# EAGLE design Explore Labs GPS Receiver ublox MAX-M8Q (EAGLE 7.5.0)
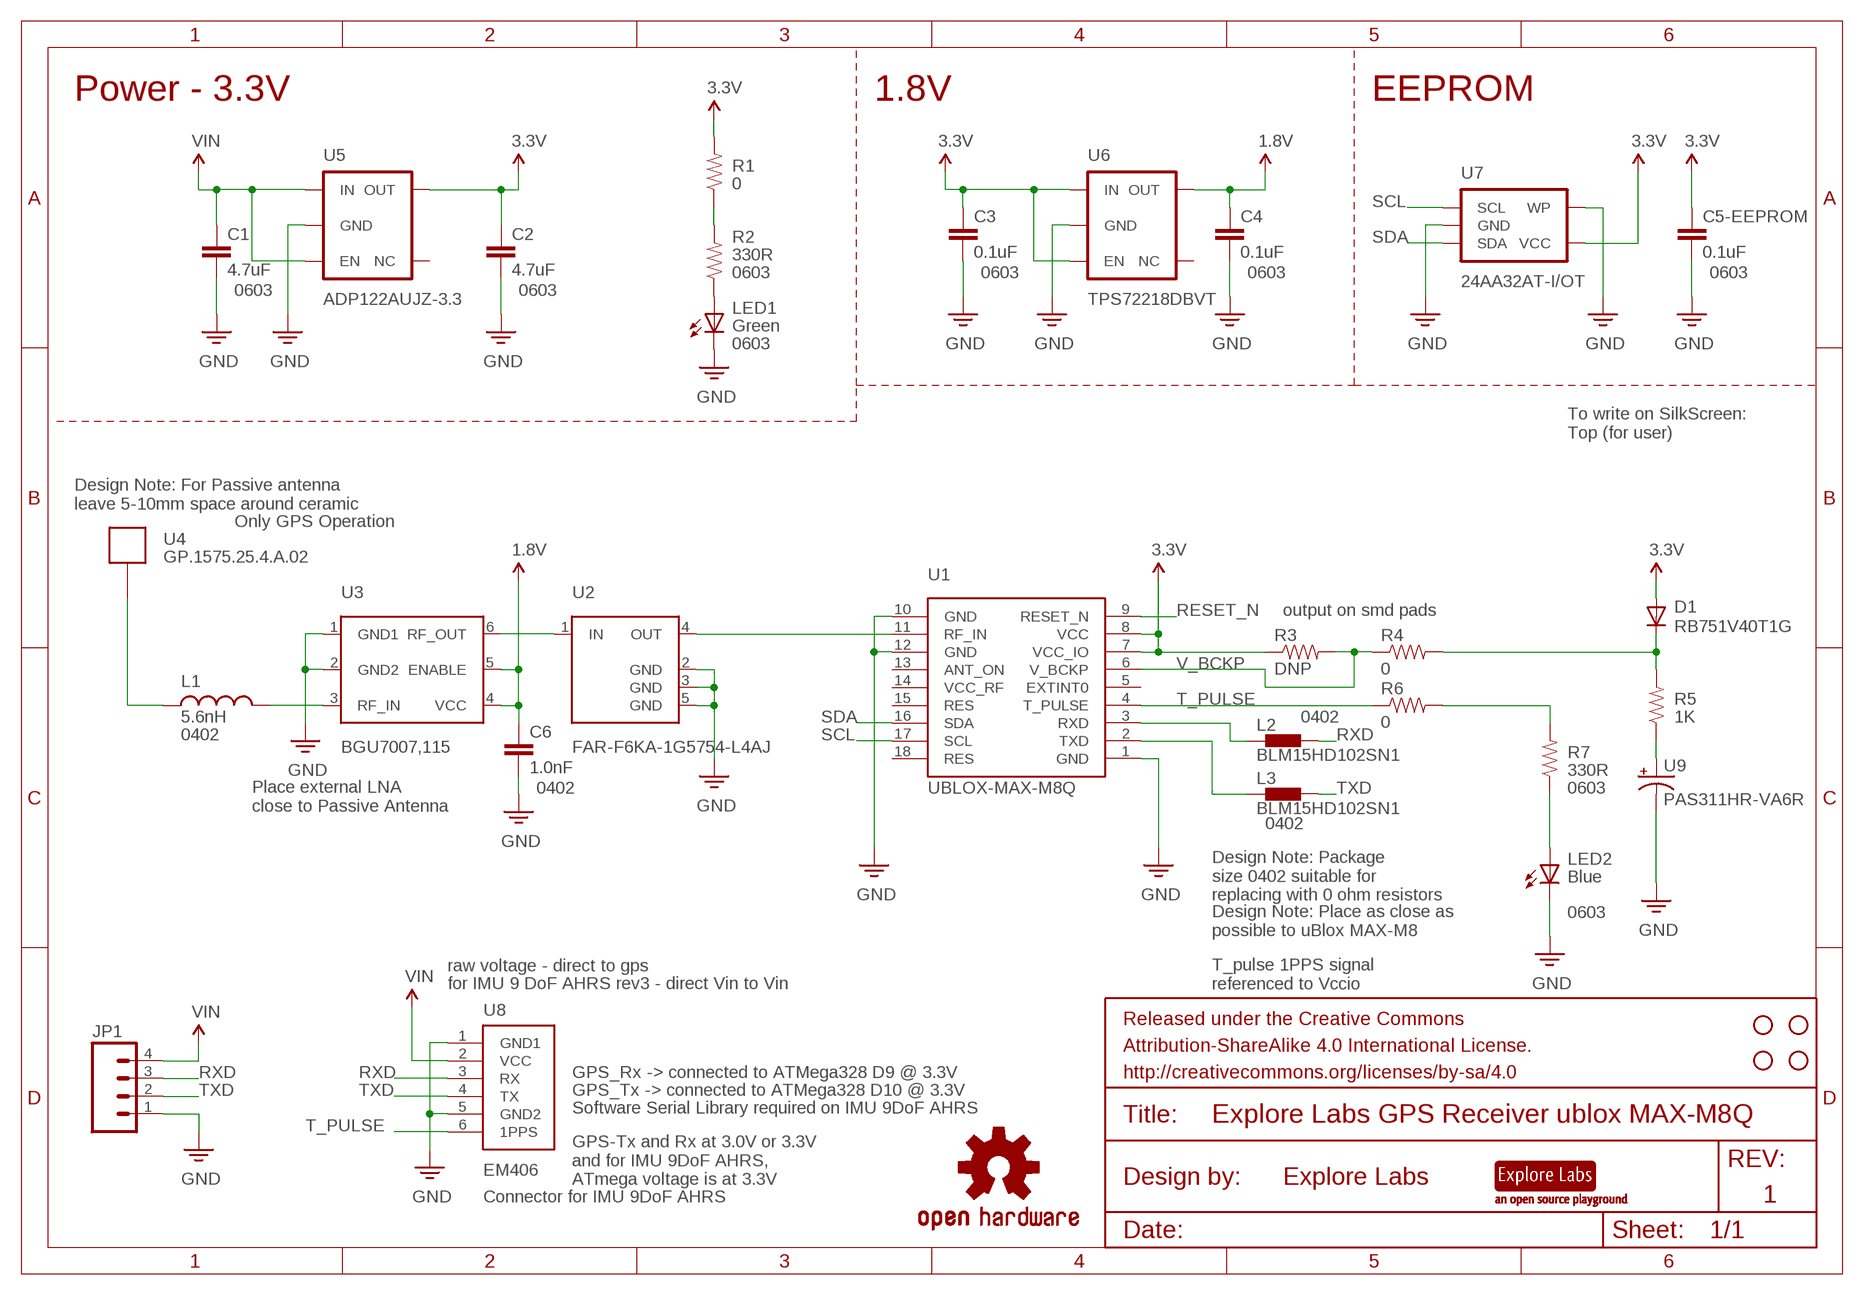
[diagram p0: schematic, sheet 1]

## Parts
C1  4.7uF  CAP0603-CAP  [0603-CAP]
C2  4.7uF  CAP0603-CAP  [0603-CAP]
C3  0.1uF  CAP0603-CAP  [0603-CAP]
C4  0.1uF  CAP0603-CAP  [0603-CAP]
C5-EEPROM  0.1uF  CAP0603-CAP  [0603-CAP]
C6  1.0nF  1.0UF-16V-10%(0402)  [0402-CAP]
D1  RB751V40T1G  DIODESOD  [SOD-323]
JP1  M04PTH  [1X04]
L1  5.6nH  INDUCTOR0402  [C0402]
L2  BLM15HD102SN1  [0402-FERRITE]
L3  BLM15HD102SN1  [0402-FERRITE]
LED1  Green  LEDCHIP-LED0603  [CHIP-LED0603]
LED2  Blue  LEDCHIP-LED0603  [CHIP-LED0603]
LOGO1  OSHW-LOGOTOP  [OSHW-LOGO-M-TOP]
LOGO2  OSHW-LOGOBOTTOM  [OSHW-LOGO-M-BOTTOM]
R1  0  RESISTOR0603-RES  [0603-RES]
R2  330R  RESISTOR0603-RES  [0603-RES]
R3  DNP  RESISTOR0603-RES  [0603-RES]
R4  0  RESISTOR0603-RES  [0603-RES]
R5  1K  RESISTOR0603-RES  [0603-RES]
R6  0  RESISTOR0603-RES  [0603-RES]
R7  330R  RESISTOR0603-RES  [0603-RES]
STANDOFF1  STAND-OFF  [STAND-OFF]
STANDOFF2  STAND-OFF  [STAND-OFF]
STANDOFF3  STAND-OFF  [STAND-OFF]
STANDOFF4  STAND-OFF  [STAND-OFF]
U1  UBLOX-MAX-M8Q  [UBLOX-MAX-M8]
U2  FAR-F6KA-1G5754-L4AJ  [QCS5E]
U3  BGU7007,115  [SOT886]
U4  GP.1575.25.4.A.02  [GP.1575.25.4.A.02]
U5  ADP122AUJZ-3.3  [SOT-23-5]
U6  TPS72218DBVT  [SOT-23-5]
U7  24AA32AT-I/OT  [SOT-23-5]
U8  EM406  [EM406]
U9  PAS311HR-VA6R  [PA311]
U$9  EXPLORE-LABS-LOGO  [EXPLORE-LABS-LOGO-TOP]

## Nets
1.8V: C4.1 C6.1 U3.4(VCC) U3.5(ENABLE) U6.5(OUT)
3.3V: C2.1 C3.1 C5-EEPROM.1 D1.2(A) R1.2 R3.1 U1.7(VCC_IO) U1.8(VCC) U5.5(OUT) U6.1(IN) U6.3(EN) U7.4(VCC)
GND: C1.2 C2.2 C3.2 C4.2 C5-EEPROM.2 C6.2 JP1.1 LED1.C LED2.C U1.1(GND) U1.10(GND) U1.12(GND) U2.2(GND) U2.3(GND) U2.5(GND) U3.1(GND1) U3.2(GND2) U5.2(GND) U6.2(GND) U7.2(GND) U7.5(WP) U8.1(GND1) U8.5(GND2) U9.P$2(-)
N$1 [RF]: U2.1(IN) U3.6(RF_OUT)
N$2: R5.1 U9.P$1(+)
N$3: L2.1 U1.3(RXD)
N$4: R6.2 R7.2
N$5: LED2.A R7.1
N$6: L3.1 U1.2(TXD)
N$7 [RF]: U1.11(RF_IN) U2.4(OUT)
N$8: D1.1(C) R4.2 R5.2
N$9 [RF]: L1.2 U3.3(RF_IN)
N$10: R1.1 R2.2
N$11 [RF]: L1.1 U4.1(PIN)
N$15: LED1.A R2.1
RESET_N: U1.9(RESET_N)
RXD: JP1.3 L2.2 U8.3(RX)
SCL: U1.17(SCL) U7.1(SCL)
SDA: U1.16(SDA) U7.3(SDA)
T_PULSE: R6.1 U1.4(T_PULSE) U8.6(1PPS)
TXD: JP1.2 L3.2 U8.4(TX)
V_BCKP: R3.2 R4.1 U1.6(V_BCKP)
VIN: C1.1 JP1.4 U5.1(IN) U5.3(EN) U8.2(VCC)
Unconnected: U1.5(EXTINT0) U1.13(ANT_ON) U1.14(VCC_RF) U1.15(RES) U1.18(RES) U5.4(NC) U6.4(NC)

## Notes on the sheet
- Power - 3.3V | 1.8V | EEPROM
- 0603 | 0603 | 0603 | 0603
- 0603 | 0603
- 0603
- To write on SilkScreen:
  Top (for user)
- Design Note: For Passive antenna
  leave 5-10mm space around ceramic
- Only GPS Operation
- output on smd pads
- 0402
- 0402
- 0402 | 0603
- Place external LNA
  close to Passive Antenna
- 0402
- Design Note: Package
  size 0402 suitable for
  replacing with 0 ohm resistors
- 0603
- Design Note: Place as close as
  possible to uBlox MAX-M8
- raw voltage - direct to gps
- for IMU 9 DoF AHRS rev3 - direct Vin to Vin
- T_pulse 1PPS signal
  referenced to Vccio
- GPS_Rx -> connected to ATMega328 D9 @ 3.3V
- GPS_Tx -> connected to ATMega328 D10 @ 3.3V
- Software Serial Library required on IMU 9DoF AHRS
- GPS-Tx and Rx at 3.0V or 3.3V
  and for IMU 9DoF AHRS,
  ATmega voltage is at 3.3V
- Connector for IMU 9DoF AHRS | 1

## Library data of the parts
C1-C4 C5-EEPROM = SparkFun-Capacitors:CAP: Capacitor Standard 0603 ceramic capacitor, and 0.1" leaded capacitor.
C6 = Explore Labs EAGLE Library:1.0UF-16V-10%(0402); PROD_ID: CAP-12417; VALUE: 1.0uF
D1 = Explore Labs EAGLE Library:DIODE: Diode These are standard reverse protection diodes and small signal diodes. SMA package can handle up to about 1A. SOD-323 can handle about 200mA. What the SOD-323 package when ordering, there are some mfgs out there that are 5-pin packages.; PROD_ID: DIO-09646
JP1 = SparkFun-Connectors:M04: Header 4 Standard 4-pin 0.1" header. Use with straight break away headers (SKU : PRT-00116), right angle break away headers (PRT-00553), swiss pins (PRT-00743), machine pins (PRT-00117), and female headers (PRT-00115). Molex polarized connector foot print use with SKU : PRT-08231 with associated crimp pins and housings. 1MM SMD Version SKU: PRT-10208
L1 = SparkFun-Passives:INDUCTOR: Inductors Basic Inductor/Choke - 0603 and 1206. Footprints are not proven and vary greatly between part numbers. INDUCTOR POWER 3.3UH 4.0A SMD 0.197" L x 0.197" W x 0.177" H (5.00mm x 5.00mm x 4.50mm)
L2 L3 = Explore Labs EAGLE Library:BLM15H: EMIFIL (R) Chip Ferrite Bead for GHz Noise Source: http://www.murata.com/ Ferrite Bead BLM15H.pdf
LED1 LED2 = adafruit:LED: LED OSRAM: - CHIPLED LG R971, LG N971, LY N971, LG Q971, LY Q971, LO R971, LY R971 LH N974, LH R974 LS Q976, LO Q976, LY Q976 LO Q996 - Hyper CHIPLED LW Q18S LB Q993, LB Q99A, LB R99A - SideLED LS A670, LO A670, LY A670, LG A670, LP A670 LB A673, LV A673, LT A673, LW A673 LH A674 LY A675 LS A676, LA A676, LO A676, LY A676, LW A676 LS A679, LY A679, LG A679 - Hyper Micro SIDELED® LS Y876, LA Y876, LO Y876, LY Y876 LT Y87S - SmartLED LW L88C, LW L88S LB L89C, LB L89S, LG L890 LS L89K, LO L89K, LY L89K LS L896, LA L896, LO L896, LY L896 - TOPLED LS T670, LO T670, LY T670, LG T670, LP T670 LSG T670, LSP T670, LSY T670, LOP T670, LYG T670 LG T671, LOG T671, LSG T671 LB T673, LV T673, LT T673, LW T673 LH T674 LS T676, LA T676, LO T676, LY T676, LB T676, LH T676, LSB T676, LW T676 LB T67C, LV T67C, LT T67C, LS T67K, LO T67K, LY T67K, LW E67C LS E67B, LA E67B, LO E67B, LY E67B, LB E67C, LV E67C, LT E67C LW T67C LS T679, LY T679, LG T679 LS T770, LO T770, LY T770, LG T770, LP T770 LB T773, LV T773, LT T773, LW T773 LH T774 LS E675, LA E675, LY E675, LS T675 LS T776, LA T776, LO T776, LY T776, LB T776 LHGB T686 LT T68C, LB T68C - Hyper Mini TOPLED® LB M676 - Mini TOPLED Santana® LG M470 LS M47K, LO M47K, LY M47K Source: http://www.osram.convergy.de/
LOGO1 LOGO2 = Explore Labs EAGLE Library:OSHW-LOGO: Open Source Hardware Logo This logo indicates the piece of hardware it is found on incorporates a OSHW license and/or adheres to the definition of open source hardware found here: http://freedomdefined.org/OSHW
R1-R7 = SparkFun-Passives:RESISTOR: Resistor Basic schematic elements and footprints for 0603, 1206, and PTH resistors.
STANDOFF1-STANDOFF4 = SparkFun-Electromechanical:STAND-OFF: #4 Stand Off This is the mechanical footprint for a #4 phillips button head screw. Use the keepout ring to avoid running the screw head into surrounding components. SKU : PRT-00447
U1 = Explore Labs EAGLE Library:UBLOX-MAX-M8
U2 = Explore Labs EAGLE Library:FAR-F6KA-1G5754-L4AJ
U3 = Explore Labs EAGLE Library:BGU7007
U4 = Explore Labs EAGLE Library:GP.1575.25.4.A.02: Taoglas GP.1575.25.4.A.02 4mm thick GPS Patch Antenna, 1575MHz 25mm*25mm*4mm; DATASHEET: http://www.taoglas.com/images/product_images/original_images/GP.1575.25.4.A.02%20GPS%20Patch%20Antenna%201575MHz%20190410.pdf; LINK: http://www.taoglas.com/antennas/GPS-GLONASS_Antennas/Internal_GPS_-_Passive_Ceramic_Patch_Antennas/; MFGPN: GP.1575.25.4.A.02
U5 = Explore Labs EAGLE Library:ADP122
U6 = Explore Labs EAGLE Library:TPS72218
U7 = Explore Labs EAGLE Library:24AA32
U8 = 11xLabs:EM406: EM406 GPS Connector Proven layout and schematic for EM406 connector. Spark Fun Electronics SKU : GPS-00579
U9 = Explore Labs EAGLE Library:PAS311
U$9 = Explore Labs EAGLE Library:EXPLORE-LABS-LOGO

## Net classes
1 RF: width 0.432 mm

## Board
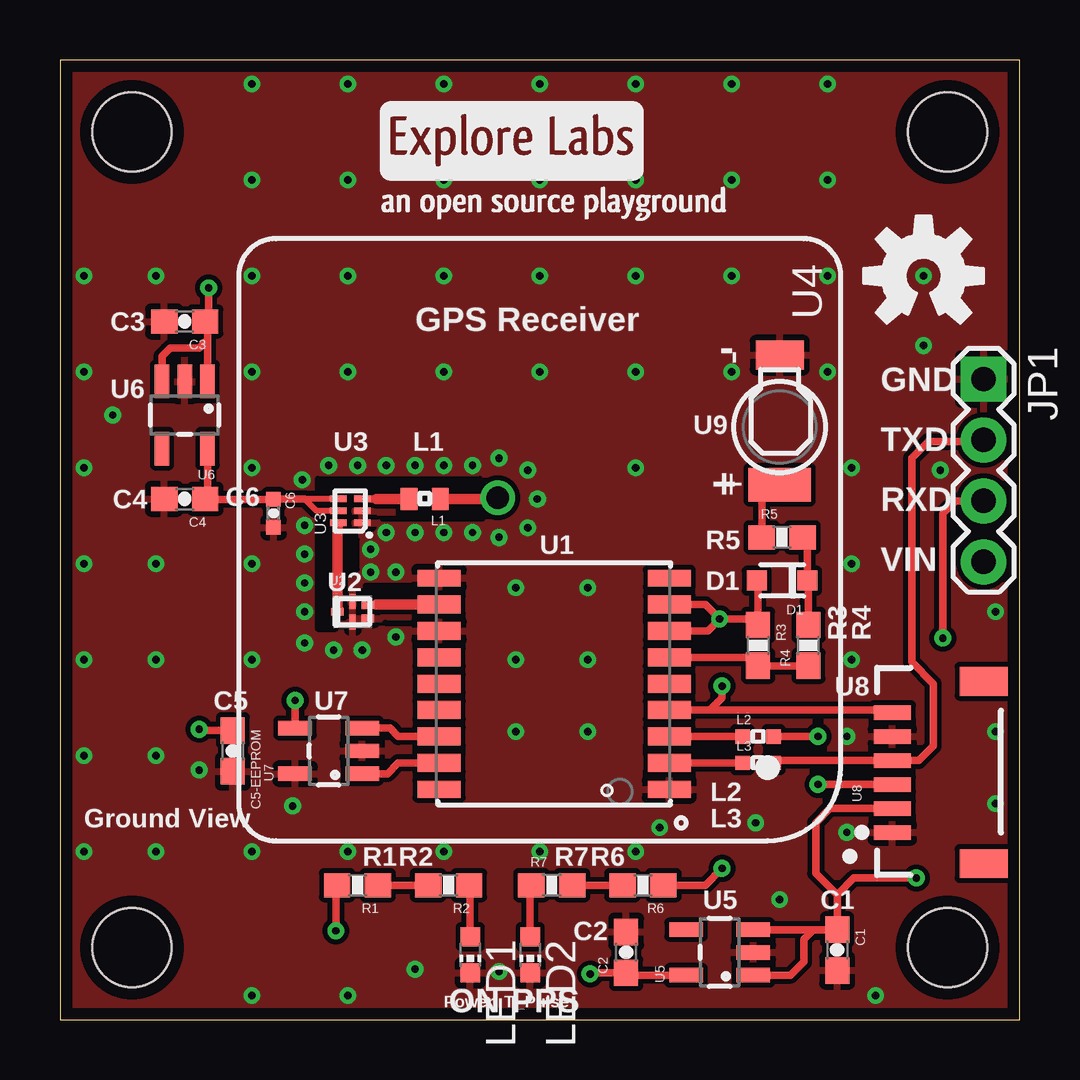
[diagram p1: board, top side]
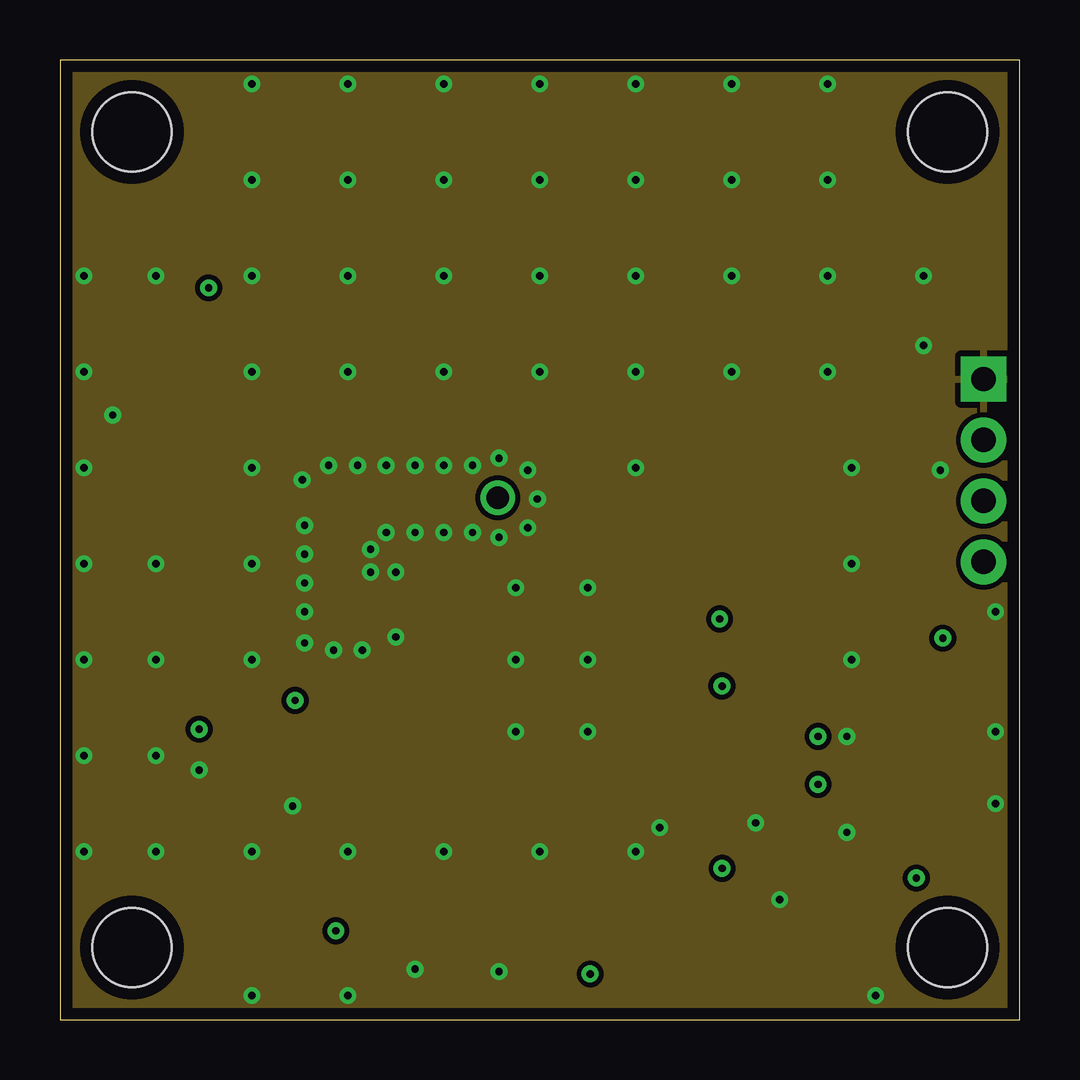
[diagram p2: board, inner layer $GND]
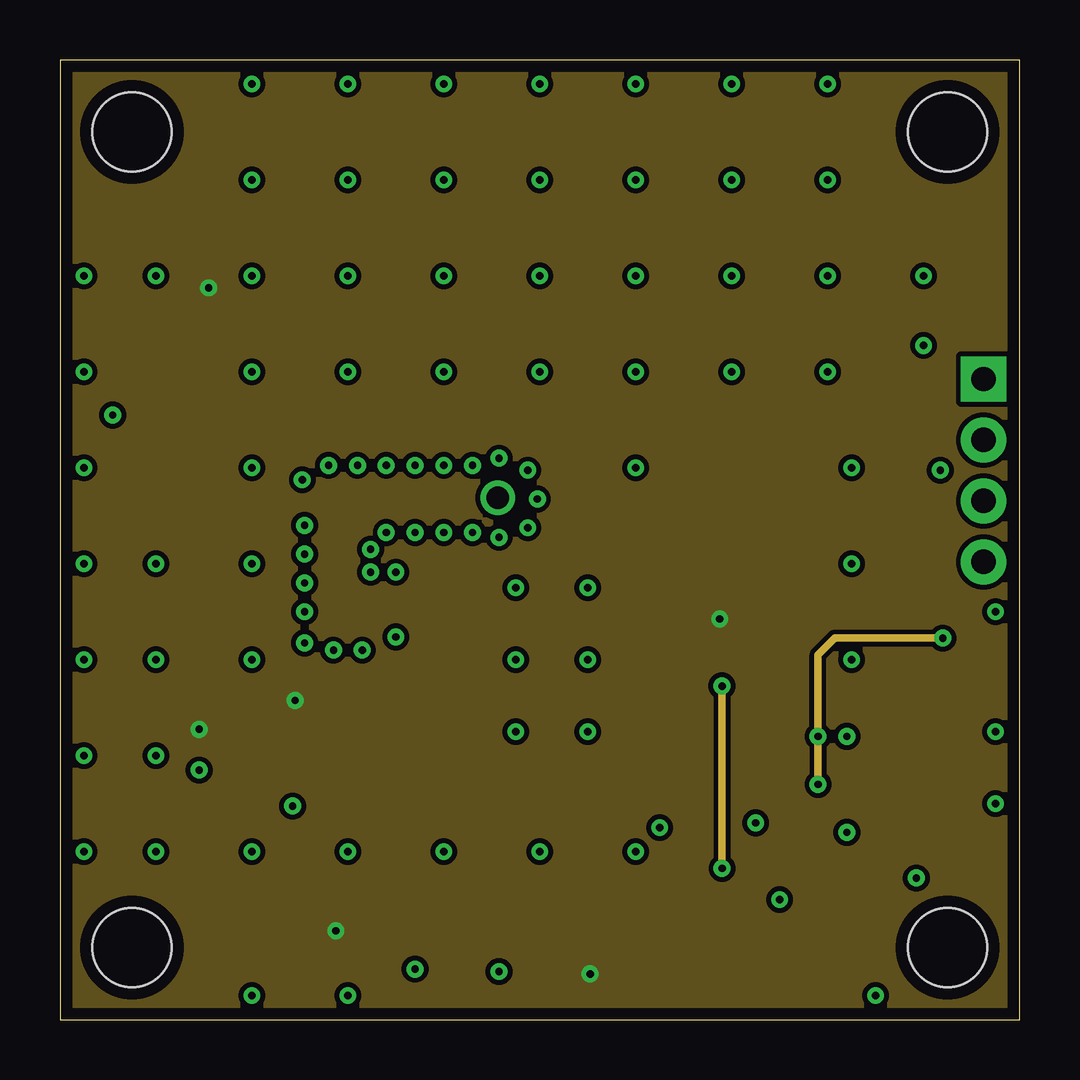
[diagram p3: board, inner layer $VCC]
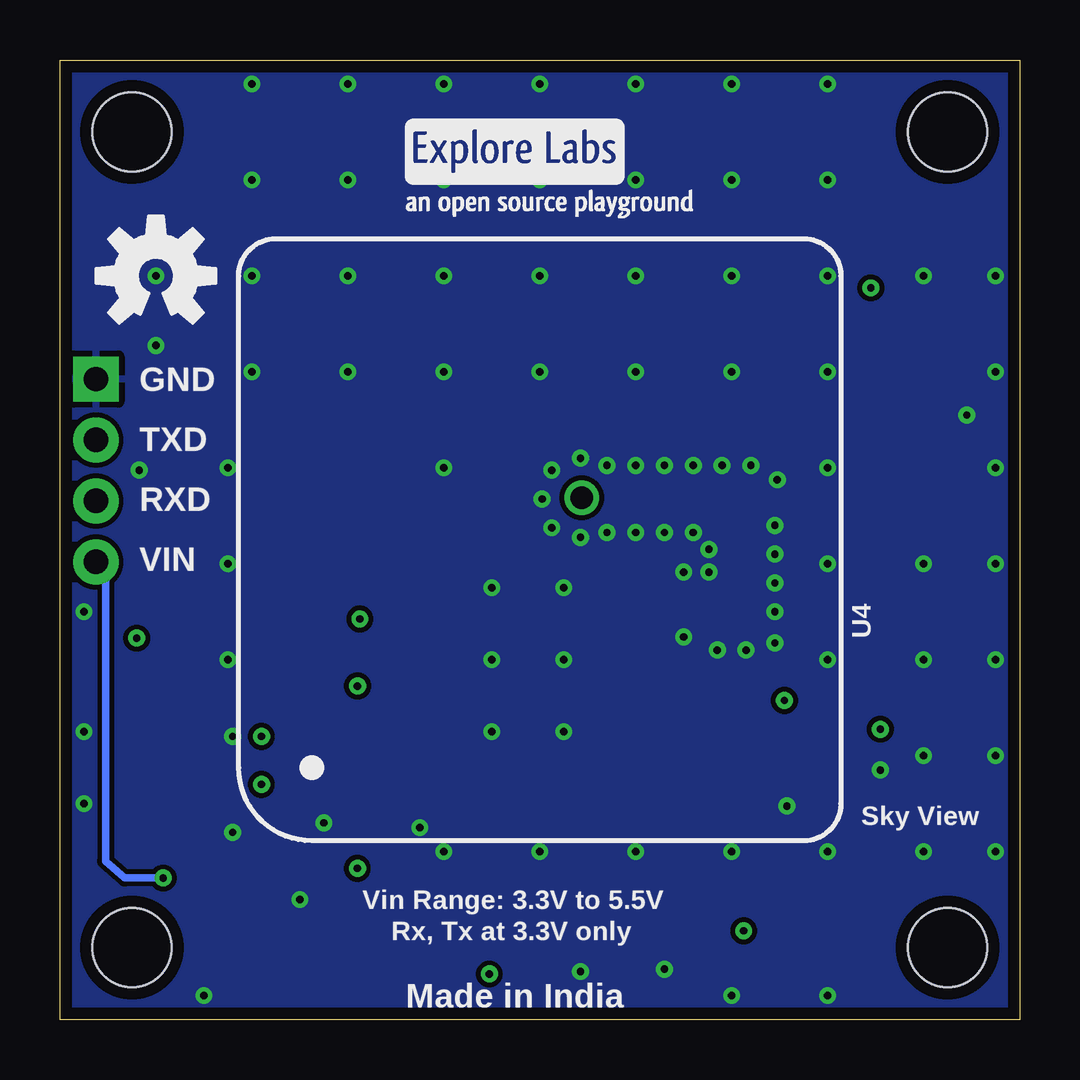
[diagram p4: board, bottom side, seen from below]

Size 40 x 40 mm. Coordinates in mm from the lower left corner, seen from the top.
Outline: 0,0 40,0 40,40 0,40 0,0
Copper layers (1+2*15+16): Top 0.035mm / dielectric 0.25mm / $GND 0.018mm / dielectric 1mm / $VCC 0.018mm / dielectric 0.255mm / Bottom 0.035mm
Design rules "Explore Labs 4 Layer 1dot61mm": minimum track width 10mil, minimum drill 10mil, track to track 8mil, track to pad 8mil, pad to pad 8mil, via to via 8mil, smd to smd 8mil, copper to edge 0.5mm, drill to drill 8mil, minimum pad ring 10mil, minimum via ring 8mil, stop-mask expansion 4mil, vias tented up to drill 18mil, thermal gap 10mil
tRestrict: 10 lines

### Footprints (pad centres in the part's own frame; a part is rotated, then mirrored left to right if it is on the bottom)
0603-CAP = smd 1.1 x 1: 1 -0.85,0; 2 0.85,0
0402-CAP = smd 0.6 x 0.6: 1 -0.58,0; 2 0.58,0
SOD-323 = smd 0.83 x 0.83: 1 -1.05,0; 2 1.05,0
1X04 = drill 1.016 pad 1.88 square: 1 0,0 | drill 1.016 pad 1.88: 2 2.54,0; 3 5.08,0; 4 7.62,0
C0402 = smd 0.7 x 0.9: 1 -0.65,0; 2 0.65,0
0402-FERRITE = smd 0.6 x 0.6: 1 -0.65,0; 2 0.65,0
CHIP-LED0603 = smd 0.8 x 0.8: A 0,-0.75; C 0,0.75
0603-RES = smd 1.1 x 1: 1 -0.85,0; 2 0.85,0
STAND-OFF = hole 3.302: 0,0
UBLOX-MAX-M8 = smd 1.8 x 0.7: 1 4.8,-4.4; 9 4.8,4.4; 10 -4.8,4.4; 18 -4.8,-4.4 | smd 1.8 x 0.75: 2 4.8,-3.3; 3 4.8,-2.2; 4 4.8,-1.1; 5 4.8,0; 6 4.8,1.1; 7 4.8,2.2; 8 4.8,3.3; 11 -4.8,3.3; 12 -4.8,2.2; 13 -4.8,1.1; 14 -4.8,0; 15 -4.8,-1.1; 16 -4.8,-2.2; 17 -4.8,-3.3
QCS5E = smd 0.525 x 0.325: 1 -0.635,0; 3 0.635,-0.285; 4 0.635,0.285 | smd 0.25 x 0.625: 2 0,-0.435; 5 0,0.435
SOT886 = smd 0.27 x 0.7: 1 -0.5,-0.5; 2 0,-0.5; 3 0.5,-0.5; 4 0.5,0.5; 5 0,0.5; 6 -0.5,0.5
GP.1575.25.4.A.02 = drill 0.95: 1 -1.75,-1.75
SOT-23-5 = smd 0.6 x 1.4: 1 -0.95,-1.4; 2 0,-1.4; 3 0.95,-1.4; 4 0.95,1.4; 5 -0.95,1.4
EM406 = smd 0.6 x 1.55: 1 -2.5,1.8; 2 -1.5,1.8; 3 -0.5,1.8; 4 0.5,1.8; 5 1.5,1.8; 6 2.5,1.8 | smd 1.2 x 2: P$1 -3.8,-2; P$2 3.8,-2
PA311 = smd 1.4 x 2.6: P$1 -2.4,0 | smd 1.2 x 2: P$2 3,0

### Placement (x,y rotation side)
C1  32.4,2.9 270 top
C2  23.6,2.8 90 top
C3  5.2,29.1 180 top
C4  5.2,21.7 180 top
C5-EEPROM  7.2,11.2 270 top
C6  8.9,21.1 270 top
D1  30.1,18.3 180 top
JP1  38.5,26.7 270 top
L1  15.2,21.7 180 top
L2  29.1,11.8 0 top
L3  29.1,10.7 0 top
LED1  17.1,2.7 180 top
LED2  19.6,2.7 180 top
LOGO1  36,31 0 top
LOGO2  36,31 0 top
R1  12.4,5.6 180 top
R2  16.2,5.6 180 top
R3  29.1,15.6 270 top
R4  31.2,15.6 90 top
R5  30.1,20.1 0 top
R6  24.3,5.6 180 top
R7  20.5,5.6 0 top
STANDOFF1  37,37 0 top
STANDOFF2  3,3 0 top
STANDOFF3  37,3 0 top
STANDOFF4  3,37 0 top
U1  20.6,14 0 top
U2  12.2,17 0 top
U3  12.1,21.2 90 top
U4  20,20 270 top
U5  27.5,2.8 90 top
U6  5.2,25.2 180 top
U7  11.2,11.2 90 top
U8  36.5,10.3 90 top
U9  30,24.7 90 top
U$9  13.3,33 0 top
U$10  [EXLABS_LOGO_0.25]  26,32.6 0 bottom

### Tracks (layer width: path | path; a pad name or v marks a point on that pad's centre or on a via)
1.8V
  Top 0.254: U3.4 10.2,21.7 10.7,21.2 U3.5
  Top 0.305: 10.2,21.7 8.92,21.7 C6.1 6.07,21.68 C4.1 6.15,21.8 U6.5
3.3V  (via drill 0.3)
  Top 0.254: 6.15,29 C3.1 6.2,29.25
  Top 0.305: U6.3 4.25,27.65 4.6,28 5.8,28 6.15,28.35 | U6.1 6.15,28.35 | 6.15,28.35 6.15,29 | 6.2,29.25 v6.2,30.5 | C5-EEPROM.1 5.8,12.05 v5.8,12.1 | U7.4 | U7.4 v9.8,13.3 | U5.5 23.7,1.85 C2.1 22.15,1.95 v22.1,1.9 | v11.5,3.7 11.5,5.55 R1.2 | U1.8 26.9,17.3 v27.5,16.7 | U1.7 27,16.2 v27.5,16.7 | v27.5,16.7 28.85,16.7 R3.1 29.1,18.25 D1.2
  pour $VCC: 0,52 52,52 52,0 0,0
GND  (via drill 0.3)
  other vias: 10.2,17 14,18.65 10.2,19.4 13.6,20.3 17.2,20.3 14,15.95 12.6,15.4 10.2,15.7 12.4,23.1 13.6,23.1 18.3,23.4 19.5,22.9 19.5,20.5 19.9,21.7 10.2,18.2 10.2,20.6 10.1,22.5 11.2,23.1 14.8,20.3 14.8,23.1 17.2,23.1 5.8,10.4 2.2,25.2 12.95,19.6 18.3,20.1 11.4,15.4 16,23.1 16,20.3 12.95,18.65 9.7,8.9 29,8.2 32.8,11.8 32.8,7.8 12,7 18.3,2 20,39 20,35 16,39 16,35 16,31 20,31 16,27 20,27 24,27 28,27 24,39 24,35 24,31 28,39 28,35 28,31 12,39 12,35 12,31 12,27 32,39 32,35 32,31 32,27 36,31 36,28.1 8,39 8,35 8,31 8,27 8,23 24,23 4,31 8,19 4,19 4,15 8,15 4,11 4,7 8,7 16,7 20,7 24,7 33,23 33,19 33,15 34,1 30,5 8,1 14.8,2.1 12,1 1,19 1,23 1,27 1,31 1,15 1,11 1,7 36.7,22.9 39,17 39,9 39,12 25,8 19,18 22,18 22,15 19,15 19,12 22,12
  pour Top: 0,44 44,44 44,0 0,0
  pour $GND: 0,48 48,48 48,0 0,0
  pour Bottom: 0,56 57,56 57,0 0,0
N$1
  Top 0.254: 11.56,20.6 11.56,20.66 U3.6
  Top 0.305: 11.56,17.1 U2.1
  Top 0.432: 11.56,20.6 11.56,17.1
N$2
  Top 0.305: R5.1 29.25,21.95 29.3,22 29.7,22 U9.P$1
N$3
  Top 0.305: U1.3 L2.1
N$4
  Top 0.305: R7.2 R6.2
N$5
  Top 0.305: LED2.A 19.6,5.55 R7.1
N$6
  Top 0.305: U1.2 L3.1
N$7
  Top 0.254: 13.2,17.3 12.85,17.3 U2.4
  Top 0.432: U1.11 13.2,17.3
N$8
  Top 0.305: R4.2 31.2,18.25 D1.1 31.15,19.9 R5.2
N$9
  Top 0.254: 12.95,21.7 U3.3
  Top 0.305: 13.2,21.7 12.95,21.7
  Top 0.432: L1.2 13.2,21.7
N$10
  Top 0.305: R1.1 R2.2
N$11
  Top 0.432: L1.1 18.25,21.7 U4.1
N$15
  Top 0.305: LED1.A 17.1,5.55 R2.1
RXD  (via drill 0.3)
  Top 0.305: L2.2 v31.6,11.8 | v31.6,9.8 U8.3 | JP1.3 37.32,21.62 36.8,21.1 v36.8,15.9
  $VCC 0.305: v31.6,9.8 v31.6,11.8 31.6,15.2 32.3,15.9 v36.8,15.9
SCL
  Top 0.305: U1.17 14.1,10.7 13.65,10.25 U7.1
SDA
  Top 0.305: U1.16 14.1,11.8 13.75,12.15 U7.3
T_PULSE  (via drill 0.3)
  Top 0.305: 27.1,12.9 34.6,12.9 U8.6 | U1.4 27.1,12.9 | 27.1,12.9 27.6,13.4 v27.6,13.9 | R6.1 26.9,5.6 v27.6,6.3
  $VCC 0.305: v27.6,13.9 v27.6,6.3
TXD
  Top 0.305: L3.2 29.85,10.8 U8.4 35.8,10.8 36.4,11.4 36.4,14 35.5,14.9 35.5,23.4 36.2,24.1 38.44,24.1 JP1.2
V_BCKP
  Top 0.305: U1.6 28.75,15.1 R3.2 R4.1
VIN  (via drill 0.3)
  Top 0.305: 32.4,5.2 C1.1 31.4,3.75 | 32.4,5.2 33.1,5.9 v35.7,5.9 | U8.2 32.1,8.8 31.5,8.2 31.5,6.1 32.4,5.2 | 31.4,3.75 U5.3 | U5.1 30.45,1.85 31,2.4 31,3.35 31.4,3.75
  Bottom 0.305: v35.7,5.9 37.3,5.9 38.1,6.6 38.1,18.68 JP1.4

### Text on the board
tPlace: Power | T_Pulse
Reference: 1 Top | 2 GND | 3 3V3 | 4 Bottom
_tsilk: C3 | GPS Receiver | - | U6 | GND | U3 | L1 | U9 | TXD | + | C4 | C6 | RXD | R5 | U1 | VIN | U2 | D1 | R3 | R4 | U8 | C5 | U7 | L2 | Ground View | L3 | R1 | R2 | R7 | R6 | U5 | C1 | C2 | ON | PPS
_bsilk: GND | TXD | RXD | VIN | U4 | Sky View | Vin Range: 3.3V to 5.5V | Rx, Tx at 3.3V only | Made in India